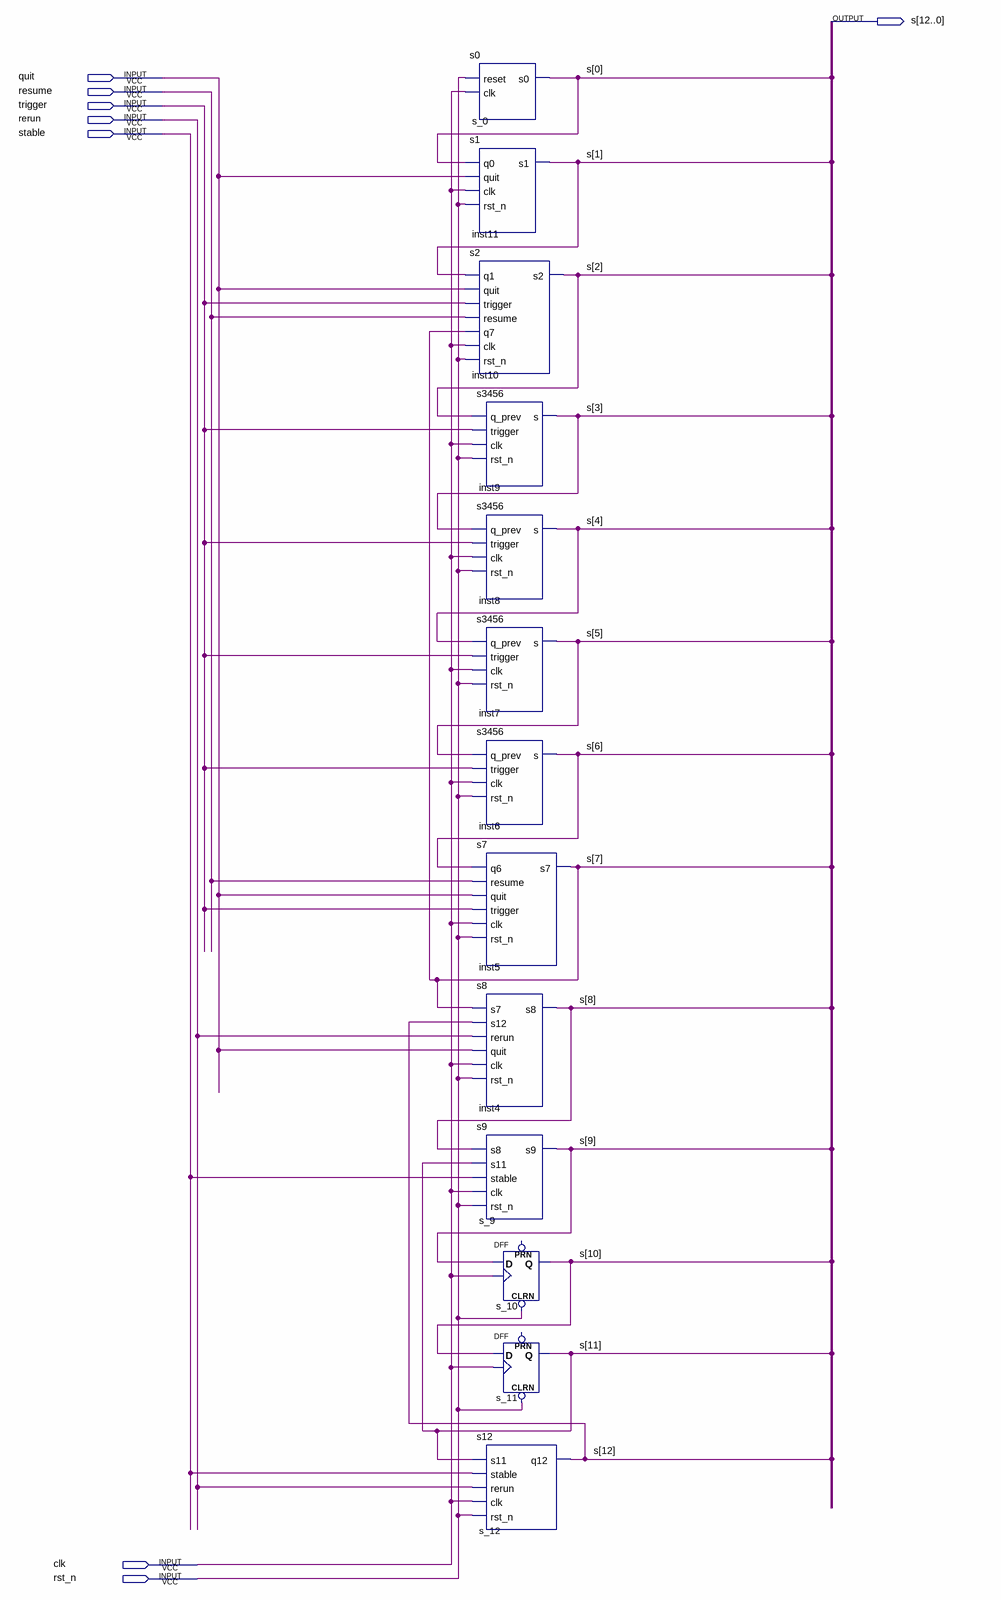
[diagram p0: schematic sheet]
// Quartus schematic ControlUnit.bdf as structural Verilog: 13 symbols, 8 pins
module ControlUnit (
  input  quit,
  input  resume,
  input  trigger,
  input  rerun,
  input  stable,
  input  clk,
  input  rst_n,
  output [12:0] s
);

  s0 s_0 (.reset(rst_n), .clk(clk), .s0(s[0]));
  s1 inst11 (.q0(s[0]), .quit(quit), .clk(clk), .rst_n(rst_n), .s1(s[1]));
  s2 inst10 (
    .q1(s[1]), .quit(quit), .trigger(trigger), .resume(resume), .q7(s[7]), .clk(clk), .rst_n(rst_n), .s2(s[2]));
  s3456 inst9 (.q_prev(s[2]), .trigger(trigger), .clk(clk), .rst_n(rst_n), .s(s[3]));
  s3456 inst8 (.q_prev(s[3]), .trigger(trigger), .clk(clk), .rst_n(rst_n), .s(s[4]));
  s3456 inst7 (.q_prev(s[4]), .trigger(trigger), .clk(clk), .rst_n(rst_n), .s(s[5]));
  s3456 inst6 (.q_prev(s[5]), .trigger(trigger), .clk(clk), .rst_n(rst_n), .s(s[6]));
  s7 inst5 (.q6(s[6]), .resume(resume), .quit(quit), .trigger(trigger), .clk(clk), .rst_n(rst_n), .s7(s[7]));
  s8 inst4 (.s7(s[7]), .s12(s[12]), .rerun(rerun), .quit(quit), .clk(clk), .rst_n(rst_n), .s8(s[8]));
  s9 s_9 (.s8(s[8]), .s11(s[11]), .stable(stable), .clk(clk), .rst_n(rst_n), .s9(s[9]));
  DFF s_10 (.CLRN(rst_n), .CLK(clk), .D(s[9]), .Q(s[10]));  // open: PRN
  DFF s_11 (.CLRN(rst_n), .CLK(clk), .D(s[10]), .Q(s[11]));  // open: PRN
  s12 s_12 (.s11(s[11]), .stable(stable), .rerun(rerun), .clk(clk), .rst_n(rst_n), .q12(s[12]));
endmodule
